# Altium schematic sheet LM704A0_5V0_PINOUT.SchDoc
size C; SheetNumber: 9; SheetTotal: 19
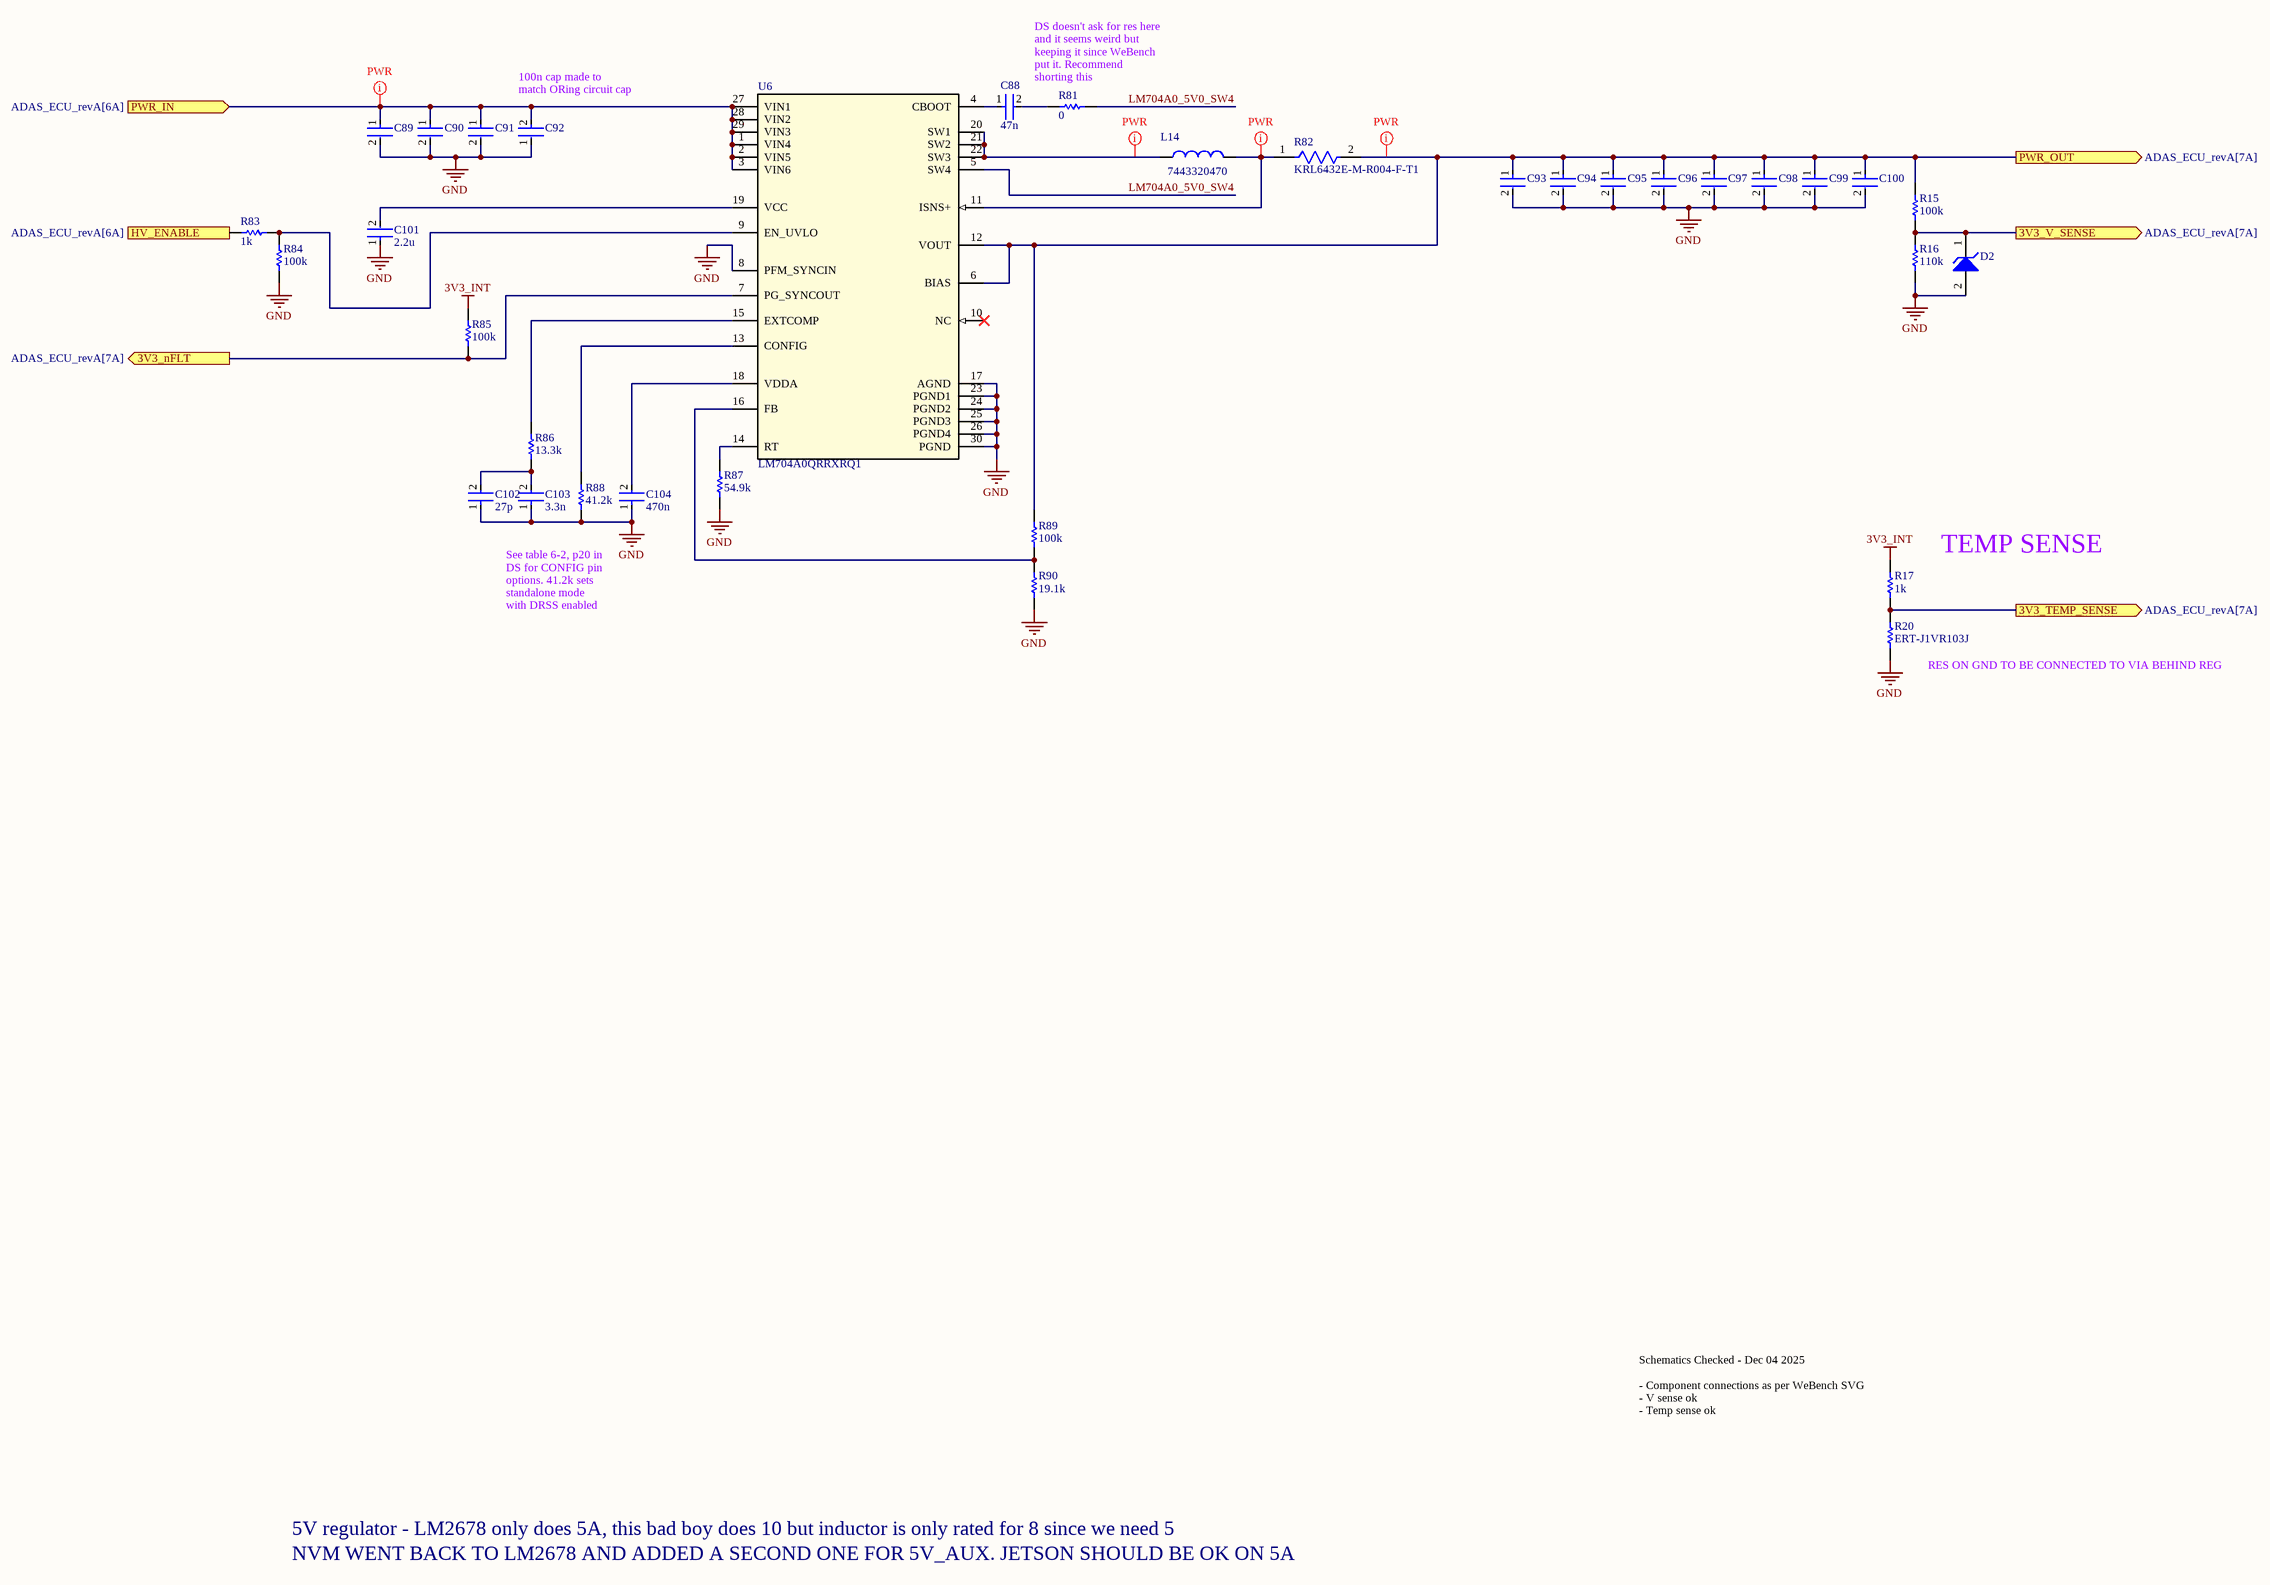
[diagram p0: LM704A0_5V0_PINOUT.SchDoc]

## Parts
C88  47n  [FP-0402-L_1_0_0_05-W_0_5-IPC_A]
C89  C3225X7R1H106M250AC  [FP-C3225-250-0_4-MFG]  (value not drawn)
C90  C3225X7R1H106M250AC  [FP-C3225-250-0_4-MFG]  (value not drawn)
C91  C3225X7R1H106M250AC  [FP-C3225-250-0_4-MFG]  (value not drawn)
C92  AC1210KKX7R0BB104  [FP-AC1210-0_85-MFG]  (value not drawn)
C93  GRM32ER61C476KE15L  [FP-GRM32E-0_3-0_2-IPC_C]  (value not drawn)
C94  GRM32ER61C476KE15L  [FP-GRM32E-0_3-0_2-IPC_C]  (value not drawn)
C95  GRM32ER61C476KE15L  [FP-GRM32E-0_3-0_2-IPC_C]  (value not drawn)
C96  GRM32ER61C476KE15L  [FP-GRM32E-0_3-0_2-IPC_C]  (value not drawn)
C97  GRM32ER61C476KE15L  [FP-GRM32E-0_3-0_2-IPC_C]  (value not drawn)
C98  GRM32ER61C476KE15L  [FP-GRM32E-0_3-0_2-IPC_C]  (value not drawn)
C99  GRM32ER61C476KE15L  [FP-GRM32E-0_3-0_2-IPC_C]  (value not drawn)
C100  GRM32ER61C476KE15L  [FP-GRM32E-0_3-0_2-IPC_C]  (value not drawn)
C101  2.2u  [FP-0402-L_1_0_0_05-W_0_5-IPC_A]
C102  27p  [FP-0402-L_1_0_0_05-W_0_5-IPC_A]
C103  3.3n  [FP-0402-L_1_0_0_05-W_0_5-IPC_A]
C104  470n  [FP-0402-L_1_0_0_05-W_0_5-IPC_A]
D2  MM5Z3V3T1G  [ONSC-SOD-523-2-502-01_V]  (value not drawn)
L14  7443320470  [WE-HCC_1210]
R15  100k  [R0603B]
R16  110k  [R0603B]
R17  1k  [R0603B]
R20  ERT-J1VR103J  [RESC1608X90X30ML15T20]
R81  0  [R0603B]
R82  KRL6432E-M-R004-F-T1  [FP-KRL6432E-MFG]
R83  1k  [R0603B]
R84  100k  [R0603B]
R85  100k  [R0603B]
R86  13.3k  [R0603B]
R87  54.9k  [R0603B]
R88  41.2k  [R0603B]
R89  100k  [R0603B]
R90  19.1k  [R0603B]
U6  LM704A0QRRXRQ1  [LM704A0QRRXRQ1-Footprint-1]

## Ports
3V3_nFLT (out, see ADAS_ECU_revA[7A]), 3V3_TEMP_SENSE (out, see ADAS_ECU_revA[7A]), 3V3_V_SENSE (out, see ADAS_ECU_revA[7A]), HV_ENABLE (in, see ADAS_ECU_revA[6A]), PWR_IN (in, see ADAS_ECU_revA[6A]), PWR_OUT (out, see ADAS_ECU_revA[7A])

## Nets
3V3_INT: R17.1 R85.2
GND: C89.2 C90.2 C91.2 C92.1 C93.2 C94.2 C95.2 C96.2 C97.2 C98.2 C99.2 C100.2 C101.1 C102.1 C103.1 C104.1 D2.2(A) R16.2 R20.1 R84.1 R87.2 R88.2 R90.2 U6.8(PFM_SYNCIN) U6.17(AGND) U6.23(PGND1) U6.24(PGND2) U6.25(PGND3) U6.26(PGND4) U6.30(PGND)
3V3_nFLT: R85.1 U6.7(PG_SYNCOUT) ; port 3V3_nFLT
3V3_TEMP_SENSE: R17.2 R20.2 ; port 3V3_TEMP_SENSE
3V3_V_SENSE: D2.1(K) R15.2 R16.1 ; port 3V3_V_SENSE
HV_ENABLE: R83.2 ; port HV_ENABLE
LM704A0_5V0_SW4: R81.2 U6.5(SW4)
PWR_IN: C89.1 C90.1 C91.1 C92.2 U6.1(VIN4) U6.2(VIN5) U6.3(VIN6) U6.27(VIN1) U6.28(VIN2) U6.29(VIN3) ; port PWR_IN
PWR_OUT: C93.1 C94.1 C95.1 C96.1 C97.1 C98.1 C99.1 C100.1 R15.1 R82.2 R89.1 U6.6(BIAS) U6.12(VOUT) ; port PWR_OUT
NetC88_1: C88.1 U6.4(CBOOT)
NetC88_2: C88.2 R81.1
NetC101_2: C101.2 U6.19(VCC)
NetC102_2: C102.2 C103.2 R86.1
NetC104_2: C104.2 U6.18(VDDA)
NetL14_1: L14.1 U6.20(SW1) U6.21(SW2) U6.22(SW3)
NetL14_2: L14.2 R82.1 U6.11(ISNS+)
NetR83_1: R83.1 R84.2 U6.9(EN_UVLO)
NetR86_2: R86.2 U6.15(EXTCOMP)
NetR87_1: R87.1 U6.14(RT)
NetR88_1: R88.1 U6.13(CONFIG)
NetR89_2: R89.2 R90.1 U6.16(FB)

Not connected (* = marked no-connect by the designer): U6 10(NC)*

## Layout directives
net class PWR: NetL14_1, NetL14_2, PWR_IN, PWR_OUT

## Notes on the sheet
- 100n cap made to match ORing circuit cap
- DS doesn't ask for res here and it seems weird but keeping it since WeBench put it. Recommend shorting this
- TEMP SENSE
- See table 6-2, p20 in DS for CONFIG pin options. 41.2k sets standalone mode with DRSS enabled
- (near R20) RES ON GND TO BE CONNECTED TO VIA BEHIND REG
- Schematics Checked - Dec 04 2025
  - Component connections as per WeBench SVG
  - V sense ok
  - Temp sense ok
- 5V regulator - LM2678 only does 5A, this bad boy does 10 but inductor is only rated for 8 since we need 5
- NVM WENT BACK TO LM2678 AND ADDED A SECOND ONE FOR 5V_AUX. JETSON SHOULD BE OK ON 5A

## Library data of the parts
C88 C101-C104 = CMP-001-00058-1: LARGE PADS, 0402 CAP, CHANGE COMMENT TO MATCH REAL P/N; Capacitor Type: Ceramic; Min Operating Temperature: -55°C; Mounting Technology: Surface Mount; Pins: 2; Case/Package: 0402; RoHS Compliant: Yes; Max Operating Temperature: 85°C
C89-C91 = CMP-08246-002653-1: Multilayer Ceramic Capacitors 10uF ±20% 50V X7R SMD 1210; Width: 0.098inch; Package Quantity: 1000; Height: 2.5mm; Dielectric Material: Ceramic; Voltage Rating: 50V; Series: C; Capacitance: 10uF; Tolerance: 20%; Weight: 0.000564oz; Case/Package: 1210; Case Code (Imperial): 1210; Dielectric: X7R; Case Code (Metric): 3225; REACH SVHC: No SVHC; Packaging: Tape and Reel; Length: 0.126inch; Termination: SMD/SMT; Min Operating Temperature: -55°C; Voltage Rating (DC): 50V; Lead Free: Lead Free; Max Operating Temperature: 125°C; Thickness: 0.11inch; Mount: Surface Mount
C92 = CMP-03422-000642-1: CAP CER 0.1UF 100V X7R 1210; Manufacturer: Yageo; Automotive Grade: Grade 1; Capacitance: 100 nF; Material: Ceramic; Value: 100 nF; Temperature Coefficient: 15%; Tolerance: 0.1; Automotive: Yes; ComponentLink2Description: Datasheet; Device Class L2: Capacitors; Height: 0.95mm; Manufacturer Part Number: AC1210KKX7R0BB104; Temperature: -55°C to +125°C; Voltage Rating: 100 V; Device Class L1: Passive Components; ComponentLink2URL: http://www.yageo.com/documents/recent/UPY-AC_NP0X7R_16V-to-630V_12.pdf; Lead Free: Yes; Category: Cap; Temperature Range High: +125°C; RoHS: TRUE; Digikey Description: CAP CER 0.1UF 100V X7R 1210; Temperature Range Low: -55°C; Octopart: https://octopart.com/ac1210kkx7r0bb104-yageo-78873719; Device Class L3: Ceramic Capacitors; Ipc Land Pattern Name: CAPC320250X85; Package: AC1210-0.85; Footprint Url: http://www.yageo.com/exep/pages/download/literatures/UPY-C_GEN_24.pdf; Temperature Characteristic: X7R
C93-C100 = CMP-2000-06362-2: CAP CER 47UF 16V X5R 1210; Tolerance: 10%; Material: Ceramic; Case Code (Metric): 3225; RoHS Compliant: Yes; Min Operating Temperature: -55°C; Radiation Hardening: No; Voltage: 16V; Package Quantity: 1; Case Code (Imperial): 1210; REACH SVHC: No SVHC; Capacitance: 47uF; Voltage Rating (DC): 16V; Dielectric: X5R; Case/Package: 1210; Length: 3.2mm; Voltage Rating: 16V; Packaging: Cut Tape; Width: 0.098inch; Number of Pins: 2; Lead Free: Lead Free; Height: 2.5mm; Mount: Surface Mount; Termination: SMD/SMT; Max Operating Temperature: 85°C; Thickness: 0.106inch; Depth: 2.5mm
D2 = CMP-1060-00750-1: Zener Voltage Regulator, 500 mW, 2-Pin SOD-523, Pb-Free, Tape and Reel; Manufacturer: On Semiconductor; P Max (W): 0.5; VZ Typ (V): 3.3; RoHS: Pb-Free; ComponentLink2Description: Datasheet; PackageReference: SOD-523-2-502-01; DatasheetVersion: Rev. 10; ComponentLink1Description: Manufacturer URL; PackageVersion: Rev. E, 09/2010; ComponentLink3URL: http://www.onsemi.com/pub_link/Collateral/502-01.PDF; ComponentLink2URL: http://www.onsemi.cn/pub_link/Collateral/MM5Z2V4T1-D.PDF; Mounting Technology: Surface Mount; PartNumber: MM5Z3V3T1G; Packing: Tape and Reel; PackageDescription: 2-Pin SOD, Body 1.2 x 0.8 mm; ComponentLink1URL: http://www.onsemi.com/; ComponentLink3Description: Package Specification
L14 = CMP-0226-00121-3: We-hcc Series, Shielded Wire-wound SMD Inductor With Ferrite Core, 4.7 Uh; Inductance Tolerance: 20%; Self Resonant Frequency: 43MHz; Saturation Current: 15.6A; Current Rating: 15.5A; Inductance: 4.7µH; DC Resistance (DCR): 7.25mΩ; Width: 11.4mm; Core Material: Ferrite; Number of Pins: 2; Material: Ferrite; RoHS: Compliant; Length: 12.1mm; Max Operating Temperature: 125°C; Ambient Temperature Range Low: -40°C; Min Operating Temperature: -40°C; Height: 9.5mm; Ambient Temperature Range High: 75°C
R15 R17 R81 R83-R90 = CMP-009-00002-14: Resistor
  R15: Value: 100k
  R17: Value: 1k
R16 = CMP-009-00002-14: Resistor; Value: 100k
R20 = CMP-2000-00869-1: Manufacturer: Panasonic; Part Number: ERT-J1VR103J
R82 = CMP-00597-24927457-1: KRL6432E-M-R004-F-T1 Metal Foil Low Resistance Chip Resistor (long-side terminal), 2512, RoHS; Power Rating: 3W; Temperature Coefficient: 50ppm/°C; Tolerance: 1%; Resistance: 4mΩ; Length: 3.1mm; Composition: Metal Foil; Termination: SMD/SMT; Max Operating Temperature: 155°C; Case Code (Imperial): 2512; NexarPartId: 24927457; Width: 6.3mm; Max Power Dissipation: 3W; Case Code (Metric): 6432; Min Operating Temperature: -55°C; Packaging: Digi-Reel®; Max Thickness: 700µm; Lifecycle Status: Production; Height: 700µm; Weight: 40.511469mg; Case/Package: 2512; RoHS: Compliant; Number of Terminations: 2
U6 = CMP-019-00058-1: Automotive, High-density, 4.5V to 45V input, 10A low-EMI synchronous DC/DC step-down converter 29-VQFN -40 to 150; Case/Package: VQFN; Pins: 29